# Altium schematic sheet ESP32_WROOM.SchDoc
size A4
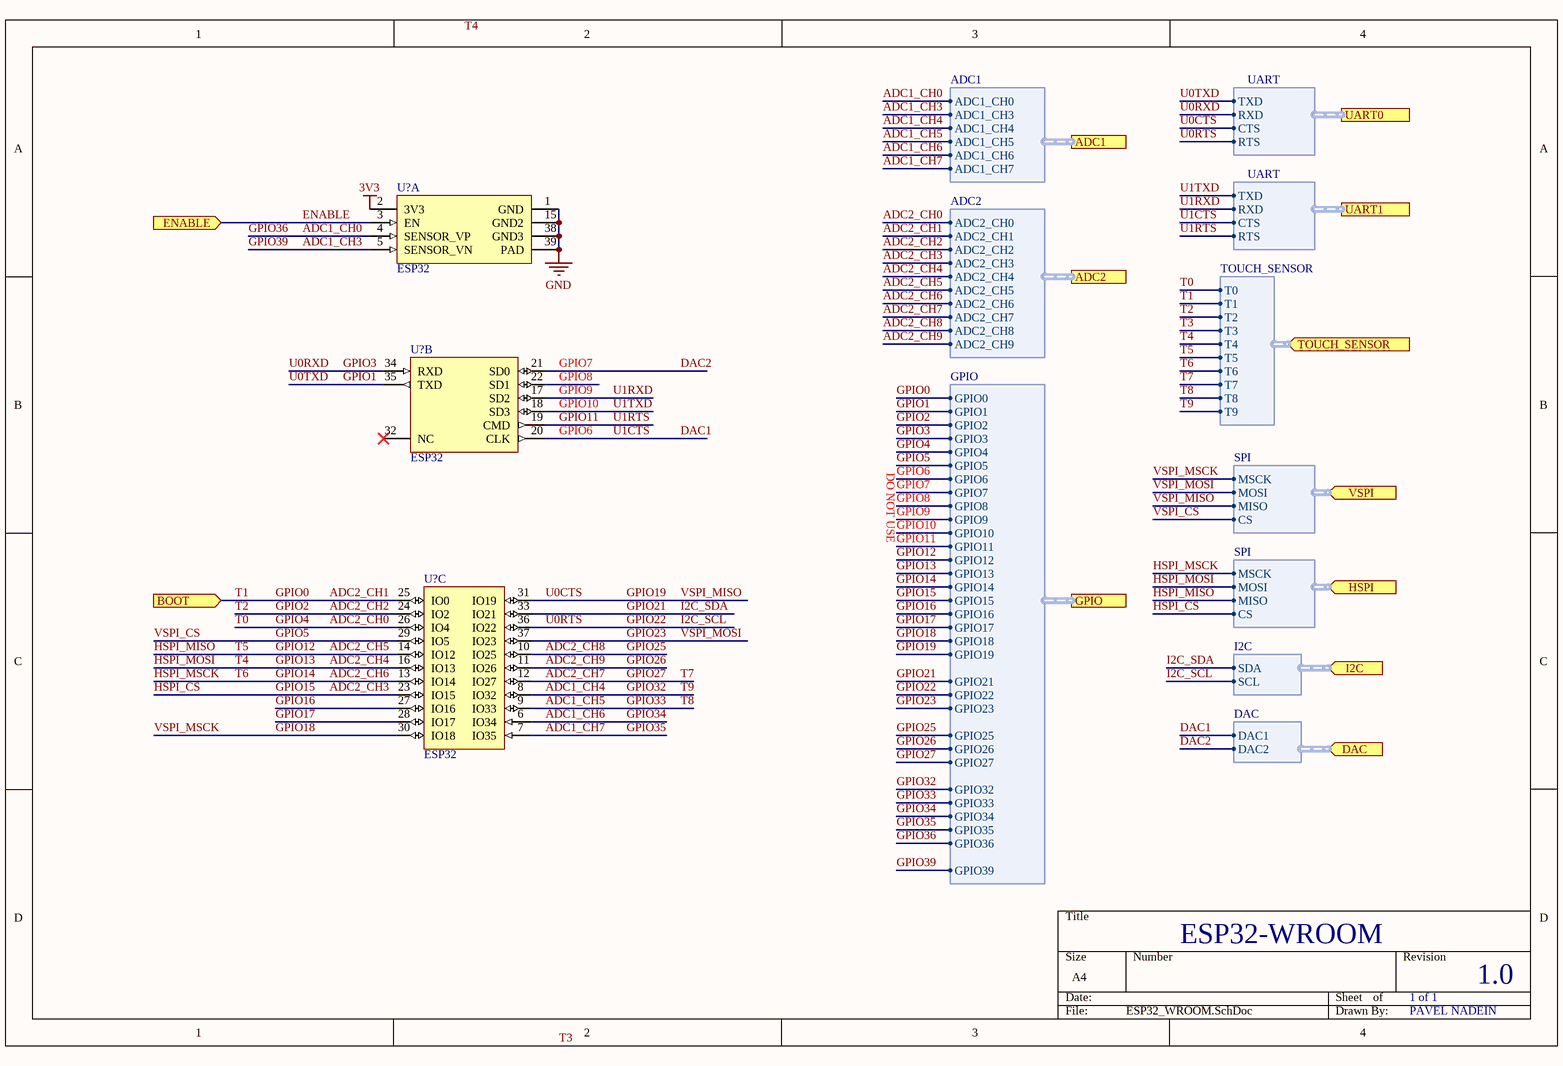
[diagram p0: ESP32_WROOM.SchDoc]

## Parts
(Parts that share a designator on the sheet are numbered #1, #2 ... from top to bottom, then left to right.)
U?#1  ESP32  [ESP32-WROOM]  (part A of 3)
U?#2  ESP32  [ESP32-WROOM]  (part B of 3)
U?#3  ESP32  [ESP32-WROOM]  (part C of 3)

## Ports
ADC1 (harness ADC1), ADC2 (harness ADC2), BOOT (in), DAC (in, harness DAC), ENABLE (in), GPIO (harness GPIO), HSPI (in, harness SPI), I2C (in, harness I2C), TOUCH_SENSOR (in, harness TOUCH_SENSOR), UART0 (harness UART), UART1 (harness UART), VSPI (in, harness SPI)

## Harnesses
ADC1: ADC1_CH0, ADC1_CH3, ADC1_CH4, ADC1_CH5, ADC1_CH6, ADC1_CH7
ADC2: ADC2_CH0, ADC2_CH1, ADC2_CH2, ADC2_CH3, ADC2_CH4, ADC2_CH5, ADC2_CH6, ADC2_CH7, ADC2_CH8, ADC2_CH9
GPIO: GPIO0, GPIO1, GPIO2, GPIO3, GPIO4, GPIO5, GPIO6, GPIO7, GPIO8, GPIO9, GPIO10, GPIO11, GPIO12, GPIO13, GPIO14, GPIO15, GPIO16, GPIO17, GPIO18, GPIO19, GPIO21, GPIO22, GPIO23, GPIO25, GPIO26, GPIO27, GPIO32, GPIO33, GPIO34, GPIO35, GPIO36, GPIO39
UART: TXD, RXD, CTS, RTS
TOUCH_SENSOR: T0, T1, T2, T3, T4, T5, T6, T7, T8, T9
SPI: MSCK, MOSI, MISO, CS
SPI: CS, MISO, MOSI, MSCK
I2C: SDA, SCL
DAC: DAC1, DAC2

## Nets
3V3: U?#1.2(3V3)
GND: U?#1.1(GND) U?#1.15(GND2) U?#1.38(GND3) U?#1.39(PAD)
ADC1_CH0: U?#1.4(SENSOR_VP) ; port ADC1.ADC1_CH0, port GPIO.GPIO36  [also labelled GPIO36]
ADC1_CH3: U?#1.5(SENSOR_VN) ; port ADC1.ADC1_CH3, port GPIO.GPIO39  [also labelled GPIO39]
ADC1_CH4: U?#3.8(IO32) ; port ADC1.ADC1_CH4, port GPIO.GPIO32, port TOUCH_SENSOR.T9  [also labelled GPIO32, T9]
ADC1_CH5: U?#3.9(IO33) ; port ADC1.ADC1_CH5, port GPIO.GPIO33, port TOUCH_SENSOR.T8  [also labelled GPIO33, T8]
ADC1_CH6: U?#3.6(IO34) ; port ADC1.ADC1_CH6, port GPIO.GPIO34  [also labelled GPIO34]
ADC1_CH7: U?#3.7(IO35) ; port ADC1.ADC1_CH7, port GPIO.GPIO35  [also labelled GPIO35]
ADC2_CH0: U?#3.26(IO4) ; port ADC2.ADC2_CH0, port GPIO.GPIO4, port TOUCH_SENSOR.T0  [also labelled GPIO4, T0]
ADC2_CH1: U?#3.25(IO0) ; port BOOT, port ADC2.ADC2_CH1, port GPIO.GPIO0, port TOUCH_SENSOR.T1  [also labelled GPIO0, T1]
ADC2_CH2: U?#3.24(IO2) ; port ADC2.ADC2_CH2, port GPIO.GPIO2, port TOUCH_SENSOR.T2  [also labelled GPIO2, T2]
ADC2_CH3: U?#3.23(IO15) ; port ADC2.ADC2_CH3, port GPIO.GPIO15, port HSPI.CS  [also labelled GPIO15, HSPI_CS]
ADC2_CH4: U?#3.16(IO13) ; port ADC2.ADC2_CH4, port GPIO.GPIO13, port TOUCH_SENSOR.T4, port HSPI.MOSI  [also labelled GPIO13, HSPI_MOSI, T4]
ADC2_CH5: U?#3.14(IO12) ; port ADC2.ADC2_CH5, port GPIO.GPIO12, port TOUCH_SENSOR.T5, port HSPI.MISO  [also labelled GPIO12, HSPI_MISO, T5]
ADC2_CH6: U?#3.13(IO14) ; port ADC2.ADC2_CH6, port GPIO.GPIO14, port TOUCH_SENSOR.T6, port HSPI.MSCK  [also labelled GPIO14, HSPI_MSCK, T6]
ADC2_CH7: U?#3.12(IO27) ; port ADC2.ADC2_CH7, port GPIO.GPIO27, port TOUCH_SENSOR.T7  [also labelled GPIO27, T7]
ADC2_CH8: U?#3.10(IO25) ; port ADC2.ADC2_CH8, port GPIO.GPIO25  [also labelled GPIO25]
ADC2_CH9: U?#3.11(IO26) ; port ADC2.ADC2_CH9, port GPIO.GPIO26  [also labelled GPIO26]
DAC1: U?#2.20(CLK) ; port GPIO.GPIO6, port UART1.CTS, port DAC.DAC1  [also labelled GPIO6, U1CTS]
DAC2: U?#2.21(SD0) ; port GPIO.GPIO7, port DAC.DAC2  [also labelled GPIO7]
ENABLE: U?#1.3(EN) ; port ENABLE
GPIO1: U?#2.35(TXD) ; port GPIO.GPIO1, port UART0.TXD  [also labelled U0TXD]
GPIO3: U?#2.34(RXD) ; port GPIO.GPIO3, port UART0.RXD  [also labelled U0RXD]
GPIO5: U?#3.29(IO5) ; port GPIO.GPIO5, port VSPI.CS  [also labelled VSPI_CS]
GPIO8: U?#2.22(SD1) ; port GPIO.GPIO8
GPIO9: U?#2.17(SD2) ; port GPIO.GPIO9, port UART1.RXD  [also labelled U1RXD]
GPIO10: U?#2.18(SD3) ; port GPIO.GPIO10, port UART1.TXD  [also labelled U1TXD]
GPIO11: U?#2.19(CMD) ; port GPIO.GPIO11, port UART1.RTS  [also labelled U1RTS]
GPIO16: U?#3.27(IO16) ; port GPIO.GPIO16
GPIO17: U?#3.28(IO17) ; port GPIO.GPIO17
GPIO18: U?#3.30(IO18) ; port GPIO.GPIO18, port VSPI.MSCK  [also labelled VSPI_MSCK]
GPIO19: U?#3.31(IO19) ; port GPIO.GPIO19, port UART0.CTS, port VSPI.MISO  [also labelled U0CTS, VSPI_MISO]
GPIO21: U?#3.33(IO21) ; port GPIO.GPIO21, port I2C.SDA  [also labelled I2C_SDA]
GPIO22: U?#3.36(IO22) ; port GPIO.GPIO22, port UART0.RTS, port I2C.SCL  [also labelled I2C_SCL, U0RTS]
GPIO23: U?#3.37(IO23) ; port GPIO.GPIO23, port VSPI.MOSI  [also labelled VSPI_MOSI]
T3: port TOUCH_SENSOR.T3

Not connected (* = marked no-connect by the designer): U?#2 32(NC)*

## Notes on the sheet
- DO NOT USE
- ESP32-WROOM
- 1 of 1
- 1.0
- PAVEL NADEIN
- Labels drawn without touching a wire or pin: T3, T4

## Library data of the parts
U?#1-U?#3 = ESP32-WROOM: ESP32-WROOM-32 is a powerful, generic Wi-Fi+BT+BLE MCU module